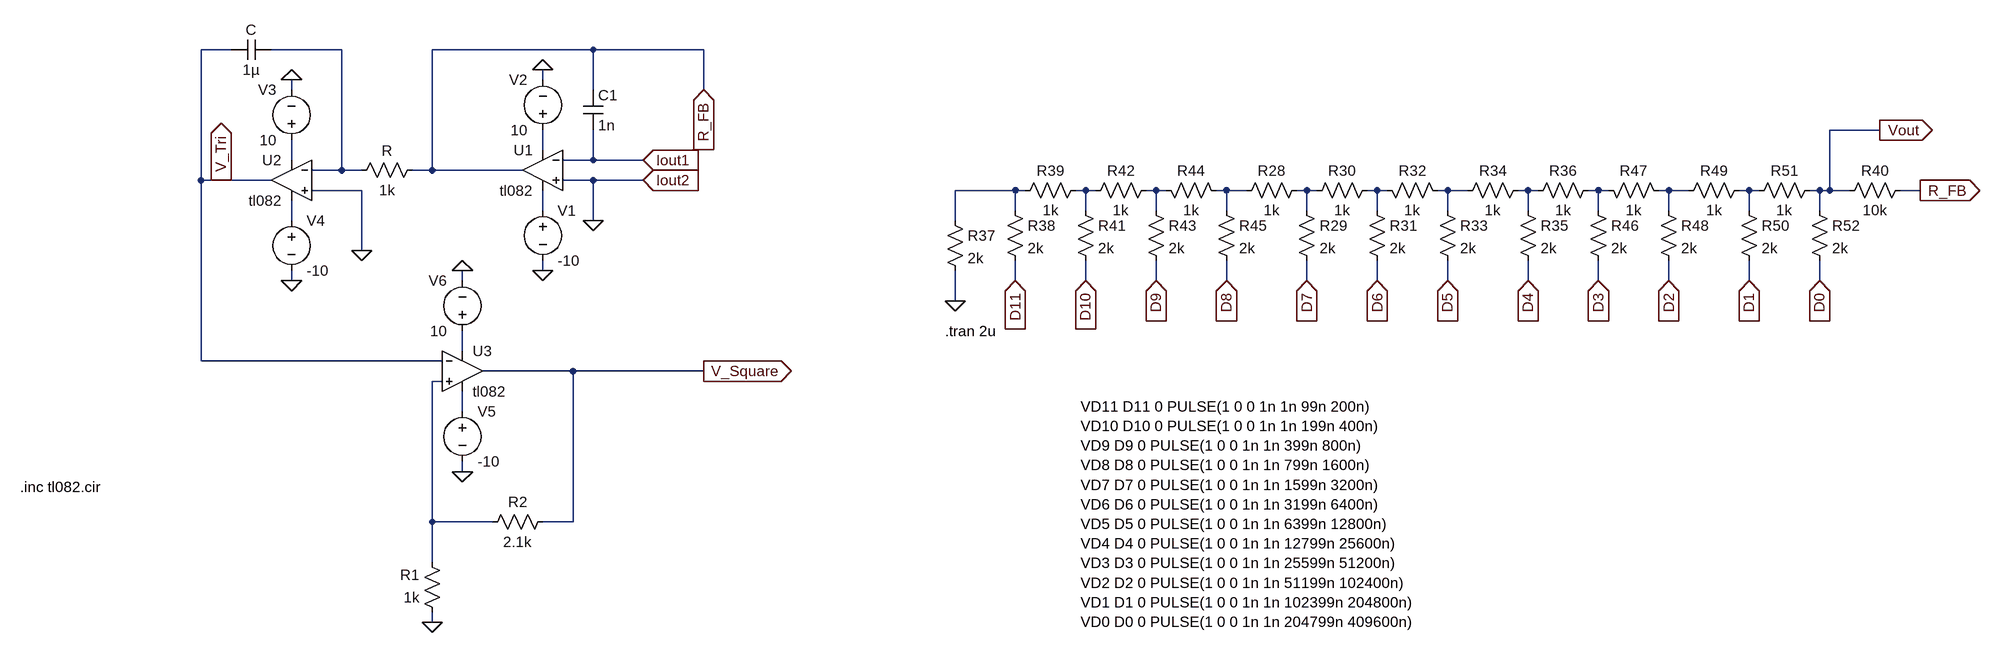
[diagram p0: schematic prog_square_and_tri_wave_generator_first_figure.asc]
prog_square_and_tri_wave_generator_first_figure.asc, the LTspice schematic file:
Version 4
SHEET 1 3844 1740
WIRE 128 -192 80 -192
WIRE 304 -192 192 -192
WIRE 704 -192 448 -192
WIRE 880 -192 704 -192
WIRE 624 -144 624 -160
WIRE 224 -128 224 -144
WIRE 704 -128 704 -192
WIRE 880 -128 880 -192
WIRE 2752 -64 2672 -64
WIRE 624 -32 624 -64
WIRE 224 -16 224 -48
WIRE 704 -16 704 -64
WIRE 704 -16 656 -16
WIRE 784 -16 704 -16
WIRE 304 0 304 -192
WIRE 304 0 256 0
WIRE 336 0 304 0
WIRE 448 0 448 -192
WIRE 448 0 416 0
WIRE 592 0 448 0
WIRE 80 16 80 -192
WIRE 112 16 80 16
WIRE 192 16 112 16
WIRE 704 16 656 16
WIRE 784 16 704 16
WIRE 336 32 256 32
WIRE 1376 32 1280 32
WIRE 1392 32 1376 32
WIRE 1488 32 1472 32
WIRE 1504 32 1488 32
WIRE 1600 32 1584 32
WIRE 1616 32 1600 32
WIRE 1712 32 1696 32
WIRE 1744 32 1712 32
WIRE 1840 32 1824 32
WIRE 1856 32 1840 32
WIRE 1952 32 1936 32
WIRE 1968 32 1952 32
WIRE 2064 32 2048 32
WIRE 2096 32 2064 32
WIRE 2192 32 2176 32
WIRE 2208 32 2192 32
WIRE 2304 32 2288 32
WIRE 2320 32 2304 32
WIRE 2416 32 2400 32
WIRE 2448 32 2416 32
WIRE 2544 32 2528 32
WIRE 2560 32 2544 32
WIRE 2656 32 2640 32
WIRE 2672 32 2672 -64
WIRE 2672 32 2656 32
WIRE 2704 32 2672 32
WIRE 2816 32 2784 32
WIRE 624 64 624 32
WIRE 1376 64 1376 32
WIRE 1488 64 1488 32
WIRE 1600 64 1600 32
WIRE 1712 64 1712 32
WIRE 1840 64 1840 32
WIRE 1952 64 1952 32
WIRE 2064 64 2064 32
WIRE 2192 64 2192 32
WIRE 2304 64 2304 32
WIRE 2416 64 2416 32
WIRE 2544 64 2544 32
WIRE 2656 64 2656 32
WIRE 224 80 224 48
WIRE 704 80 704 16
WIRE 1280 80 1280 32
WIRE 336 128 336 32
WIRE 624 160 624 144
WIRE 224 176 224 160
WIRE 496 176 496 160
WIRE 1376 176 1376 144
WIRE 1488 176 1488 144
WIRE 1600 176 1600 144
WIRE 1712 176 1712 144
WIRE 1840 176 1840 144
WIRE 1952 176 1952 144
WIRE 2064 176 2064 144
WIRE 2192 176 2192 144
WIRE 2304 176 2304 144
WIRE 2416 176 2416 144
WIRE 2544 176 2544 144
WIRE 2656 176 2656 144
WIRE 1280 208 1280 160
WIRE 496 288 496 256
WIRE 80 304 80 16
WIRE 464 304 80 304
WIRE 672 320 528 320
WIRE 880 320 672 320
WIRE 464 336 448 336
WIRE 496 384 496 352
WIRE 496 480 496 464
WIRE 448 560 448 336
WIRE 544 560 448 560
WIRE 672 560 672 320
WIRE 672 560 624 560
WIRE 448 624 448 560
WIRE 448 720 448 704
FLAG 784 -16 Iout1
IOPIN 784 -16 In
FLAG 784 16 Iout2
IOPIN 784 16 In
FLAG 880 -128 R_FB
IOPIN 880 -128 In
FLAG 624 -160 0
FLAG 624 160 0
FLAG 224 -144 0
FLAG 224 176 0
FLAG 336 128 0
FLAG 496 480 0
FLAG 496 160 0
FLAG 448 720 0
FLAG 880 320 V_Square
IOPIN 880 320 Out
FLAG 704 80 0
FLAG 1280 208 0
FLAG 2752 -64 Vout
IOPIN 2752 -64 Out
FLAG 1376 176 D11
IOPIN 1376 176 In
FLAG 1488 176 D10
IOPIN 1488 176 In
FLAG 1600 176 D9
IOPIN 1600 176 In
FLAG 1712 176 D8
IOPIN 1712 176 In
FLAG 1840 176 D7
IOPIN 1840 176 In
FLAG 1952 176 D6
IOPIN 1952 176 In
FLAG 2064 176 D5
IOPIN 2064 176 In
FLAG 2192 176 D4
IOPIN 2192 176 In
FLAG 2304 176 D3
IOPIN 2304 176 In
FLAG 2416 176 D2
IOPIN 2416 176 In
FLAG 2544 176 D1
IOPIN 2544 176 In
FLAG 2656 176 D0
IOPIN 2656 176 In
FLAG 2816 32 R_FB
IOPIN 2816 32 Out
FLAG 112 16 V_Tri
IOPIN 112 16 Out
SYMBOL Opamps\\opamp2 624 -64 M0
SYMATTR InstName U1
SYMATTR Value tl082
SYMBOL Opamps\\opamp2 224 -48 M0
SYMATTR InstName U2
SYMATTR Value tl082
SYMBOL Opamps\\opamp2 496 256 R0
SYMATTR InstName U3
SYMATTR Value tl082
SYMBOL cap 688 -128 R0
SYMATTR InstName C1
SYMATTR Value 1n
SYMBOL voltage 624 48 R0
WINDOW 123 0 0 Left 0
WINDOW 39 0 0 Left 0
SYMATTR InstName V1
SYMATTR Value -10
SYMBOL voltage 624 -48 R180
WINDOW 0 24 96 Left 2
WINDOW 3 24 16 Left 2
WINDOW 123 0 0 Left 0
WINDOW 39 0 0 Left 0
SYMATTR InstName V2
SYMATTR Value 10
SYMBOL res 432 -16 R90
WINDOW 0 0 56 VBottom 2
WINDOW 3 32 56 VTop 2
SYMATTR InstName R
SYMATTR Value 1k
SYMBOL cap 192 -208 R90
WINDOW 0 0 32 VBottom 2
WINDOW 3 32 32 VTop 2
SYMATTR InstName C
SYMATTR Value 1µ
SYMBOL voltage 224 -32 R180
WINDOW 0 24 96 Left 2
WINDOW 3 24 16 Left 2
WINDOW 123 0 0 Left 0
WINDOW 39 0 0 Left 0
SYMATTR InstName V3
SYMATTR Value 10
SYMBOL voltage 224 64 R0
WINDOW 123 0 0 Left 0
WINDOW 39 0 0 Left 0
SYMATTR InstName V4
SYMATTR Value -10
SYMBOL voltage 496 368 R0
WINDOW 123 0 0 Left 0
WINDOW 39 0 0 Left 0
SYMATTR InstName V5
SYMATTR Value -10
SYMBOL voltage 496 272 R180
WINDOW 0 24 96 Left 2
WINDOW 3 24 16 Left 2
WINDOW 123 0 0 Left 0
WINDOW 39 0 0 Left 0
SYMATTR InstName V6
SYMATTR Value 10
SYMBOL res 640 544 R90
WINDOW 0 0 56 VBottom 2
WINDOW 3 32 56 VTop 2
SYMATTR InstName R2
SYMATTR Value 2.1k
SYMBOL res 464 720 R180
WINDOW 0 36 76 Left 2
WINDOW 3 36 40 Left 2
SYMATTR InstName R1
SYMATTR Value 1k
SYMBOL res 1264 64 R0
SYMATTR InstName R37
SYMATTR Value 2k
SYMBOL res 1360 48 R0
SYMATTR InstName R38
SYMATTR Value 2k
SYMBOL res 1376 48 R270
WINDOW 0 32 56 VTop 2
WINDOW 3 0 56 VBottom 2
SYMATTR InstName R39
SYMATTR Value 1k
SYMBOL res 2800 16 R90
WINDOW 0 0 56 VBottom 2
WINDOW 3 32 56 VTop 2
SYMATTR InstName R40
SYMATTR Value 10k
SYMBOL res 1472 48 R0
SYMATTR InstName R41
SYMATTR Value 2k
SYMBOL res 1488 48 R270
WINDOW 0 32 56 VTop 2
WINDOW 3 0 56 VBottom 2
SYMATTR InstName R42
SYMATTR Value 1k
SYMBOL res 1584 48 R0
SYMATTR InstName R43
SYMATTR Value 2k
SYMBOL res 1712 48 M270
WINDOW 0 32 56 VTop 2
WINDOW 3 0 56 VBottom 2
SYMATTR InstName R44
SYMATTR Value 1k
SYMBOL res 1696 48 R0
SYMATTR InstName R45
SYMATTR Value 2k
SYMBOL res 1728 48 R270
WINDOW 0 32 56 VTop 2
WINDOW 3 0 56 VBottom 2
SYMATTR InstName R28
SYMATTR Value 1k
SYMBOL res 1824 48 R0
SYMATTR InstName R29
SYMATTR Value 2k
SYMBOL res 1840 48 R270
WINDOW 0 32 56 VTop 2
WINDOW 3 0 56 VBottom 2
SYMATTR InstName R30
SYMATTR Value 1k
SYMBOL res 1936 48 R0
SYMATTR InstName R31
SYMATTR Value 2k
SYMBOL res 2064 48 M270
WINDOW 0 32 56 VTop 2
WINDOW 3 0 56 VBottom 2
SYMATTR InstName R32
SYMATTR Value 1k
SYMBOL res 2048 48 R0
SYMATTR InstName R33
SYMATTR Value 2k
SYMBOL res 2080 48 R270
WINDOW 0 32 56 VTop 2
WINDOW 3 0 56 VBottom 2
SYMATTR InstName R34
SYMATTR Value 1k
SYMBOL res 2176 48 R0
SYMATTR InstName R35
SYMATTR Value 2k
SYMBOL res 2192 48 R270
WINDOW 0 32 56 VTop 2
WINDOW 3 0 56 VBottom 2
SYMATTR InstName R36
SYMATTR Value 1k
SYMBOL res 2288 48 R0
SYMATTR InstName R46
SYMATTR Value 2k
SYMBOL res 2416 48 M270
WINDOW 0 32 56 VTop 2
WINDOW 3 0 56 VBottom 2
SYMATTR InstName R47
SYMATTR Value 1k
SYMBOL res 2400 48 R0
SYMATTR InstName R48
SYMATTR Value 2k
SYMBOL res 2432 48 R270
WINDOW 0 32 56 VTop 2
WINDOW 3 0 56 VBottom 2
SYMATTR InstName R49
SYMATTR Value 1k
SYMBOL res 2528 48 R0
SYMATTR InstName R50
SYMATTR Value 2k
SYMBOL res 2544 48 R270
WINDOW 0 32 56 VTop 2
WINDOW 3 0 56 VBottom 2
SYMATTR InstName R51
SYMATTR Value 1k
SYMBOL res 2640 48 R0
SYMATTR InstName R52
SYMATTR Value 2k
TEXT -208 504 Left 2 !.inc tl082.cir
TEXT 1264 256 Left 2 !.tran 2u
TEXT 1480 376 Left 2 !VD11 D11 0 PULSE(1 0 0 1n 1n 99n 200n)\nVD10 D10 0 PULSE(1 0 0 1n 1n 199n 400n)\nVD9 D9 0 PULSE(1 0 0 1n 1n 399n 800n)\nVD8 D8 0 PULSE(1 0 0 1n 1n 799n 1600n)\nVD7 D7 0 PULSE(1 0 0 1n 1n 1599n 3200n)\nVD6 D6 0 PULSE(1 0 0 1n 1n 3199n 6400n)\nVD5 D5 0 PULSE(1 0 0 1n 1n 6399n 12800n)\nVD4 D4 0 PULSE(1 0 0 1n 1n 12799n 25600n)\nVD3 D3 0 PULSE(1 0 0 1n 1n 25599n 51200n)\nVD2 D2 0 PULSE(1 0 0 1n 1n 51199n 102400n)\nVD1 D1 0 PULSE(1 0 0 1n 1n 102399n 204800n)\nVD0 D0 0 PULSE(1 0 0 1n 1n 204799n 409600n)

The netlist it stands for:
* prog_square_and_tri_wave_generator_first_figure.asc
XU1 0 Iout1 N002 N015 R_FB tl082  ; pins In+ In- V+ V- OUT
XU2 0 N001 N003 N016 V_Tri tl082  ; pins In+ In- V+ V- OUT
XU3 N018 V_Tri N017 N019 V_Square tl082  ; pins In+ In- V+ V- OUT
C1 R_FB Iout1 1n
V1 N015 0 -10
V2 N002 0 10
R R_FB N001 1k
C N001 V_Tri 1µ
V3 N003 0 10
V4 N016 0 -10
V5 N019 0 -10
V6 N017 0 10
R2 V_Square N018 2.1k
R1 0 N018 1k
R37 N004 0 2k
R38 N004 D11 2k
R39 N004 N005 1k
R40 R_FB Vout 10k
R41 N005 D10 2k
R42 N005 N006 1k
R43 N006 D9 2k
R44 N007 N006 1k
R45 N007 D8 2k
R28 N007 N008 1k
R29 N008 D7 2k
R30 N008 N009 1k
R31 N009 D6 2k
R32 N010 N009 1k
R33 N010 D5 2k
R34 N010 N011 1k
R35 N011 D4 2k
R36 N011 N012 1k
R46 N012 D3 2k
R47 N013 N012 1k
R48 N013 D2 2k
R49 N013 N014 1k
R50 N014 D1 2k
R51 N014 Vout 1k
R52 Vout D0 2k
.inc tl082.cir
.tran 2u
VD11 D11 0 PULSE(1 0 0 1n 1n 99n 200n)
VD10 D10 0 PULSE(1 0 0 1n 1n 199n 400n)
VD9 D9 0 PULSE(1 0 0 1n 1n 399n 800n)
VD8 D8 0 PULSE(1 0 0 1n 1n 799n 1600n)
VD7 D7 0 PULSE(1 0 0 1n 1n 1599n 3200n)
VD6 D6 0 PULSE(1 0 0 1n 1n 3199n 6400n)
VD5 D5 0 PULSE(1 0 0 1n 1n 6399n 12800n)
VD4 D4 0 PULSE(1 0 0 1n 1n 12799n 25600n)
VD3 D3 0 PULSE(1 0 0 1n 1n 25599n 51200n)
VD2 D2 0 PULSE(1 0 0 1n 1n 51199n 102400n)
VD1 D1 0 PULSE(1 0 0 1n 1n 102399n 204800n)
VD0 D0 0 PULSE(1 0 0 1n 1n 204799n 409600n)
.backanno
.end